# EasyEDA Pro project ProPrj_Embedded Tools_2024-11-13.epro, schematic Communication

## Sheets
1 Misc: Board Name: Communication; Create Date: 2024-09-08; Page Name: Misc; Project Name: Embedded Tools; Schematic Name: Communication; Update Date: 2024-11-03; Company: 嘉立创EDA; Page Size: A4; Version: V1.0
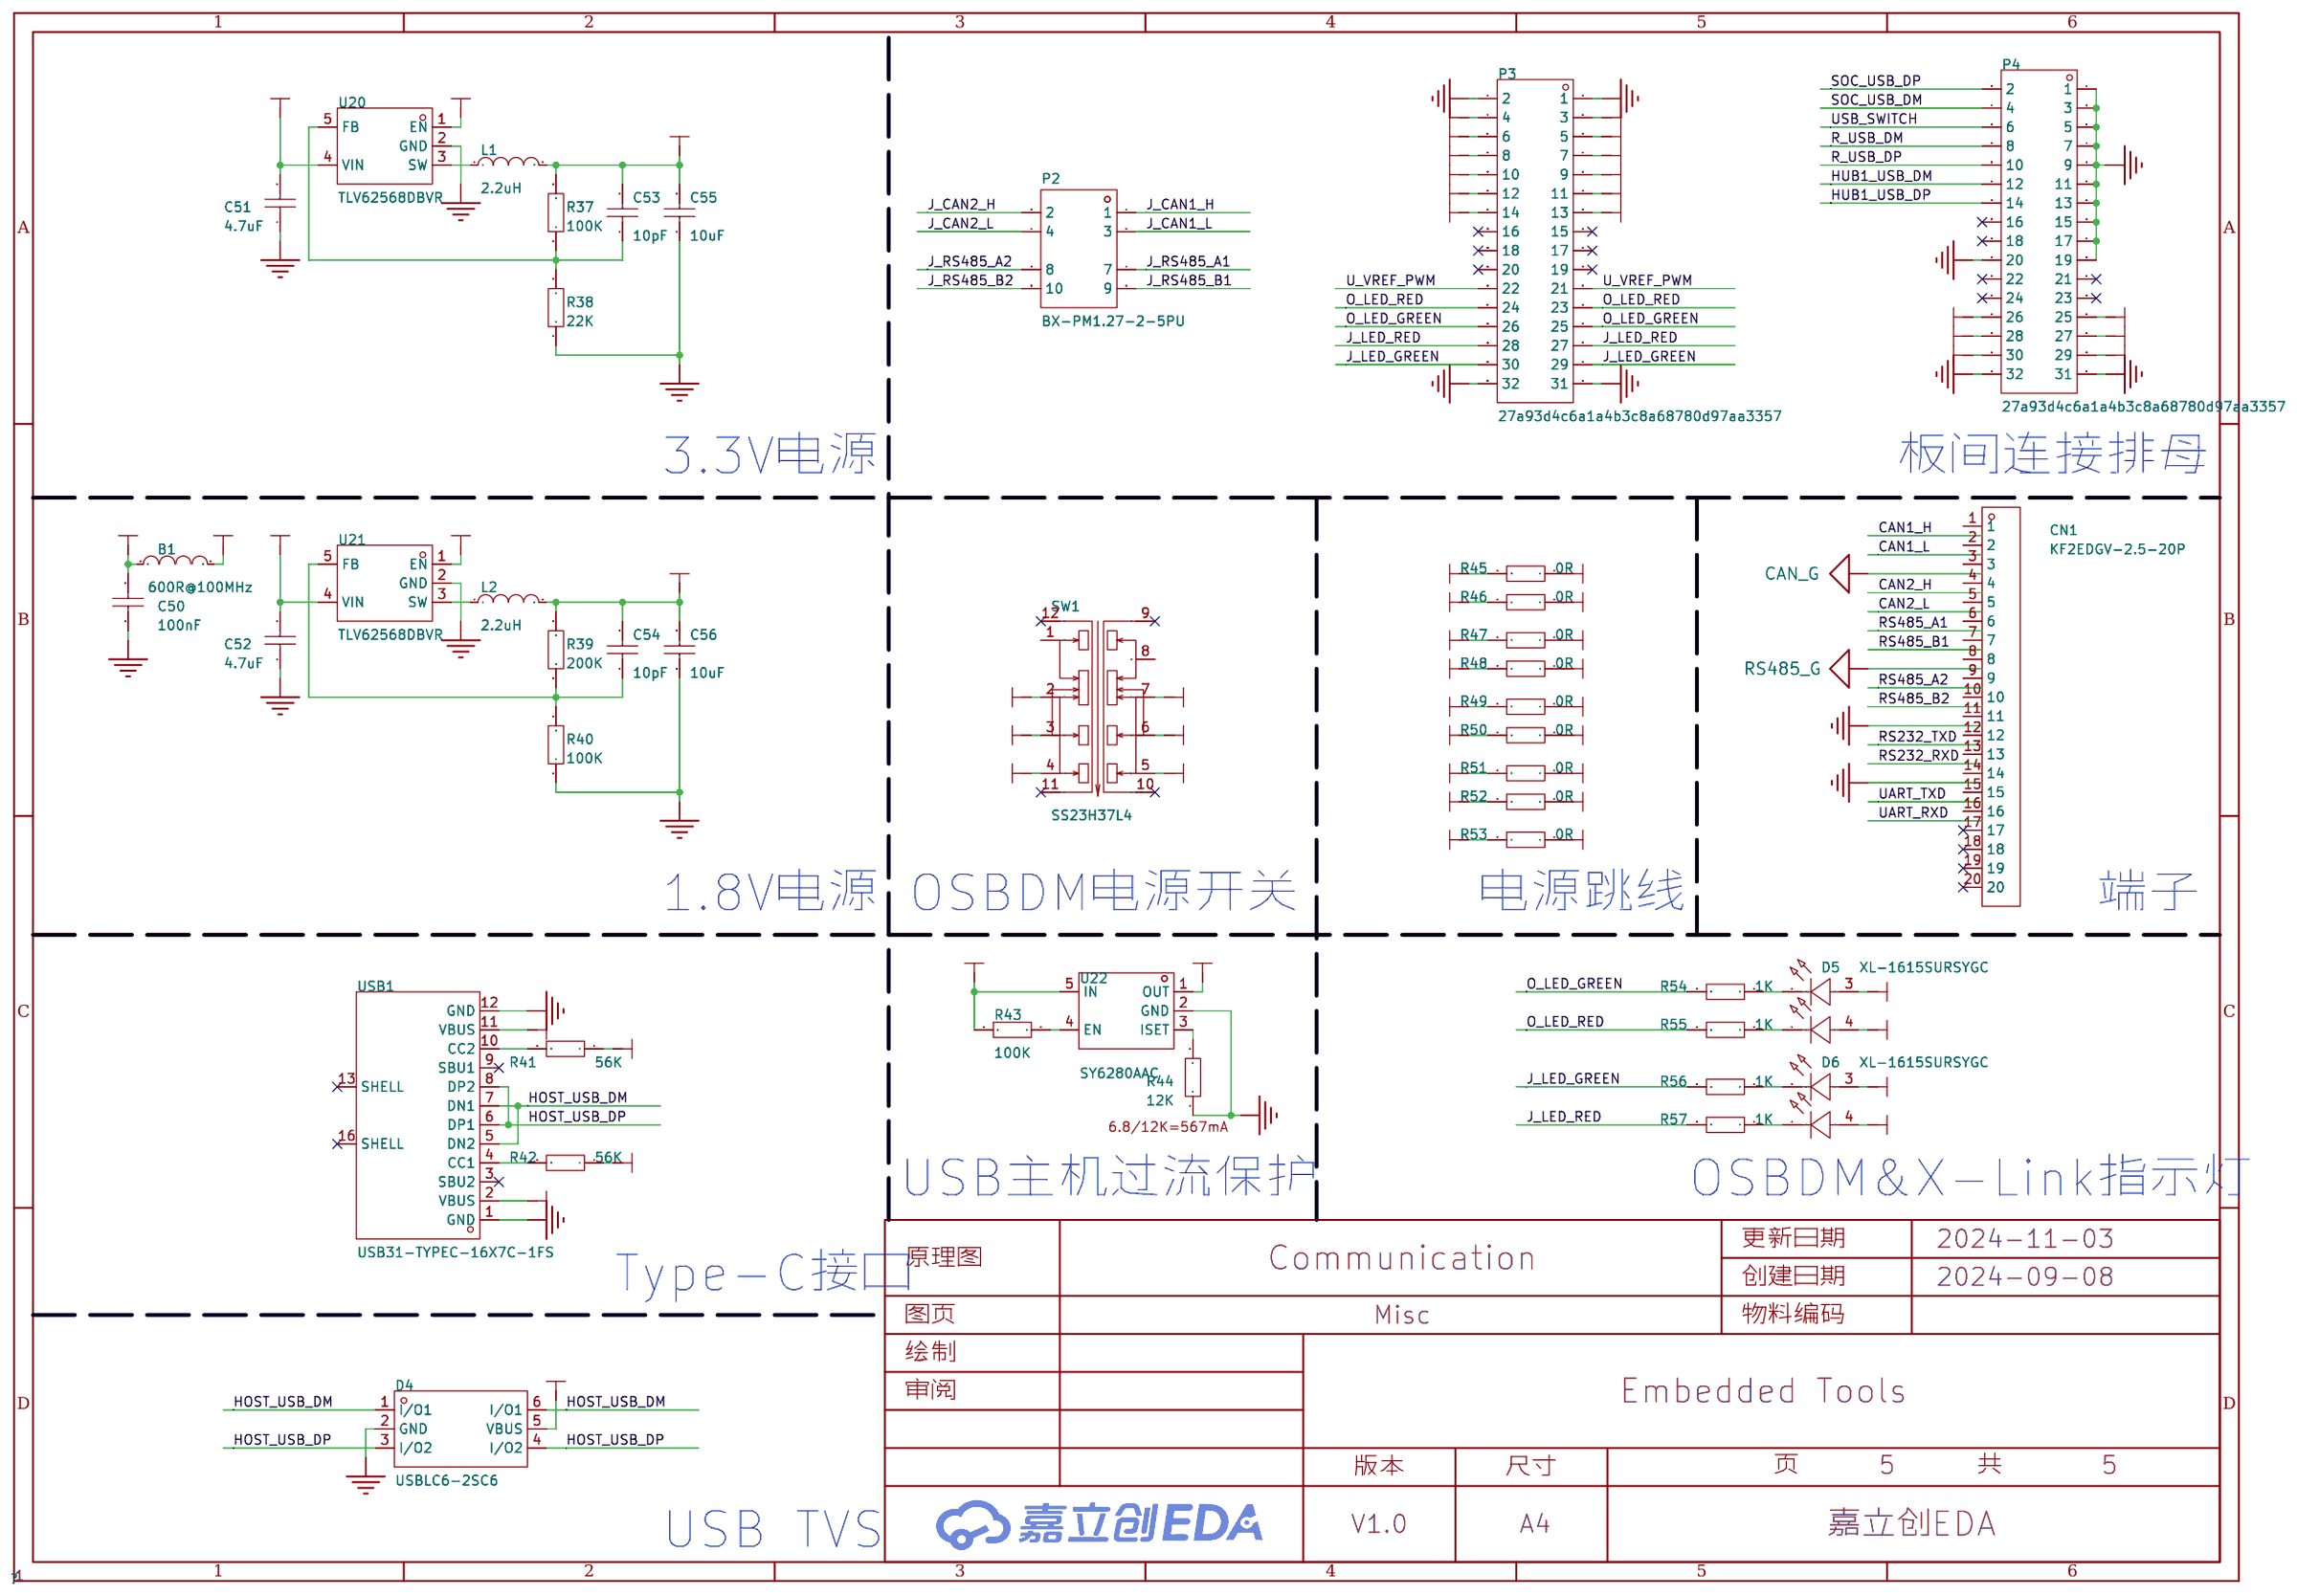
[diagram p0: Misc]
2 UART: Create Date: 2024-09-13; Page Name: UART
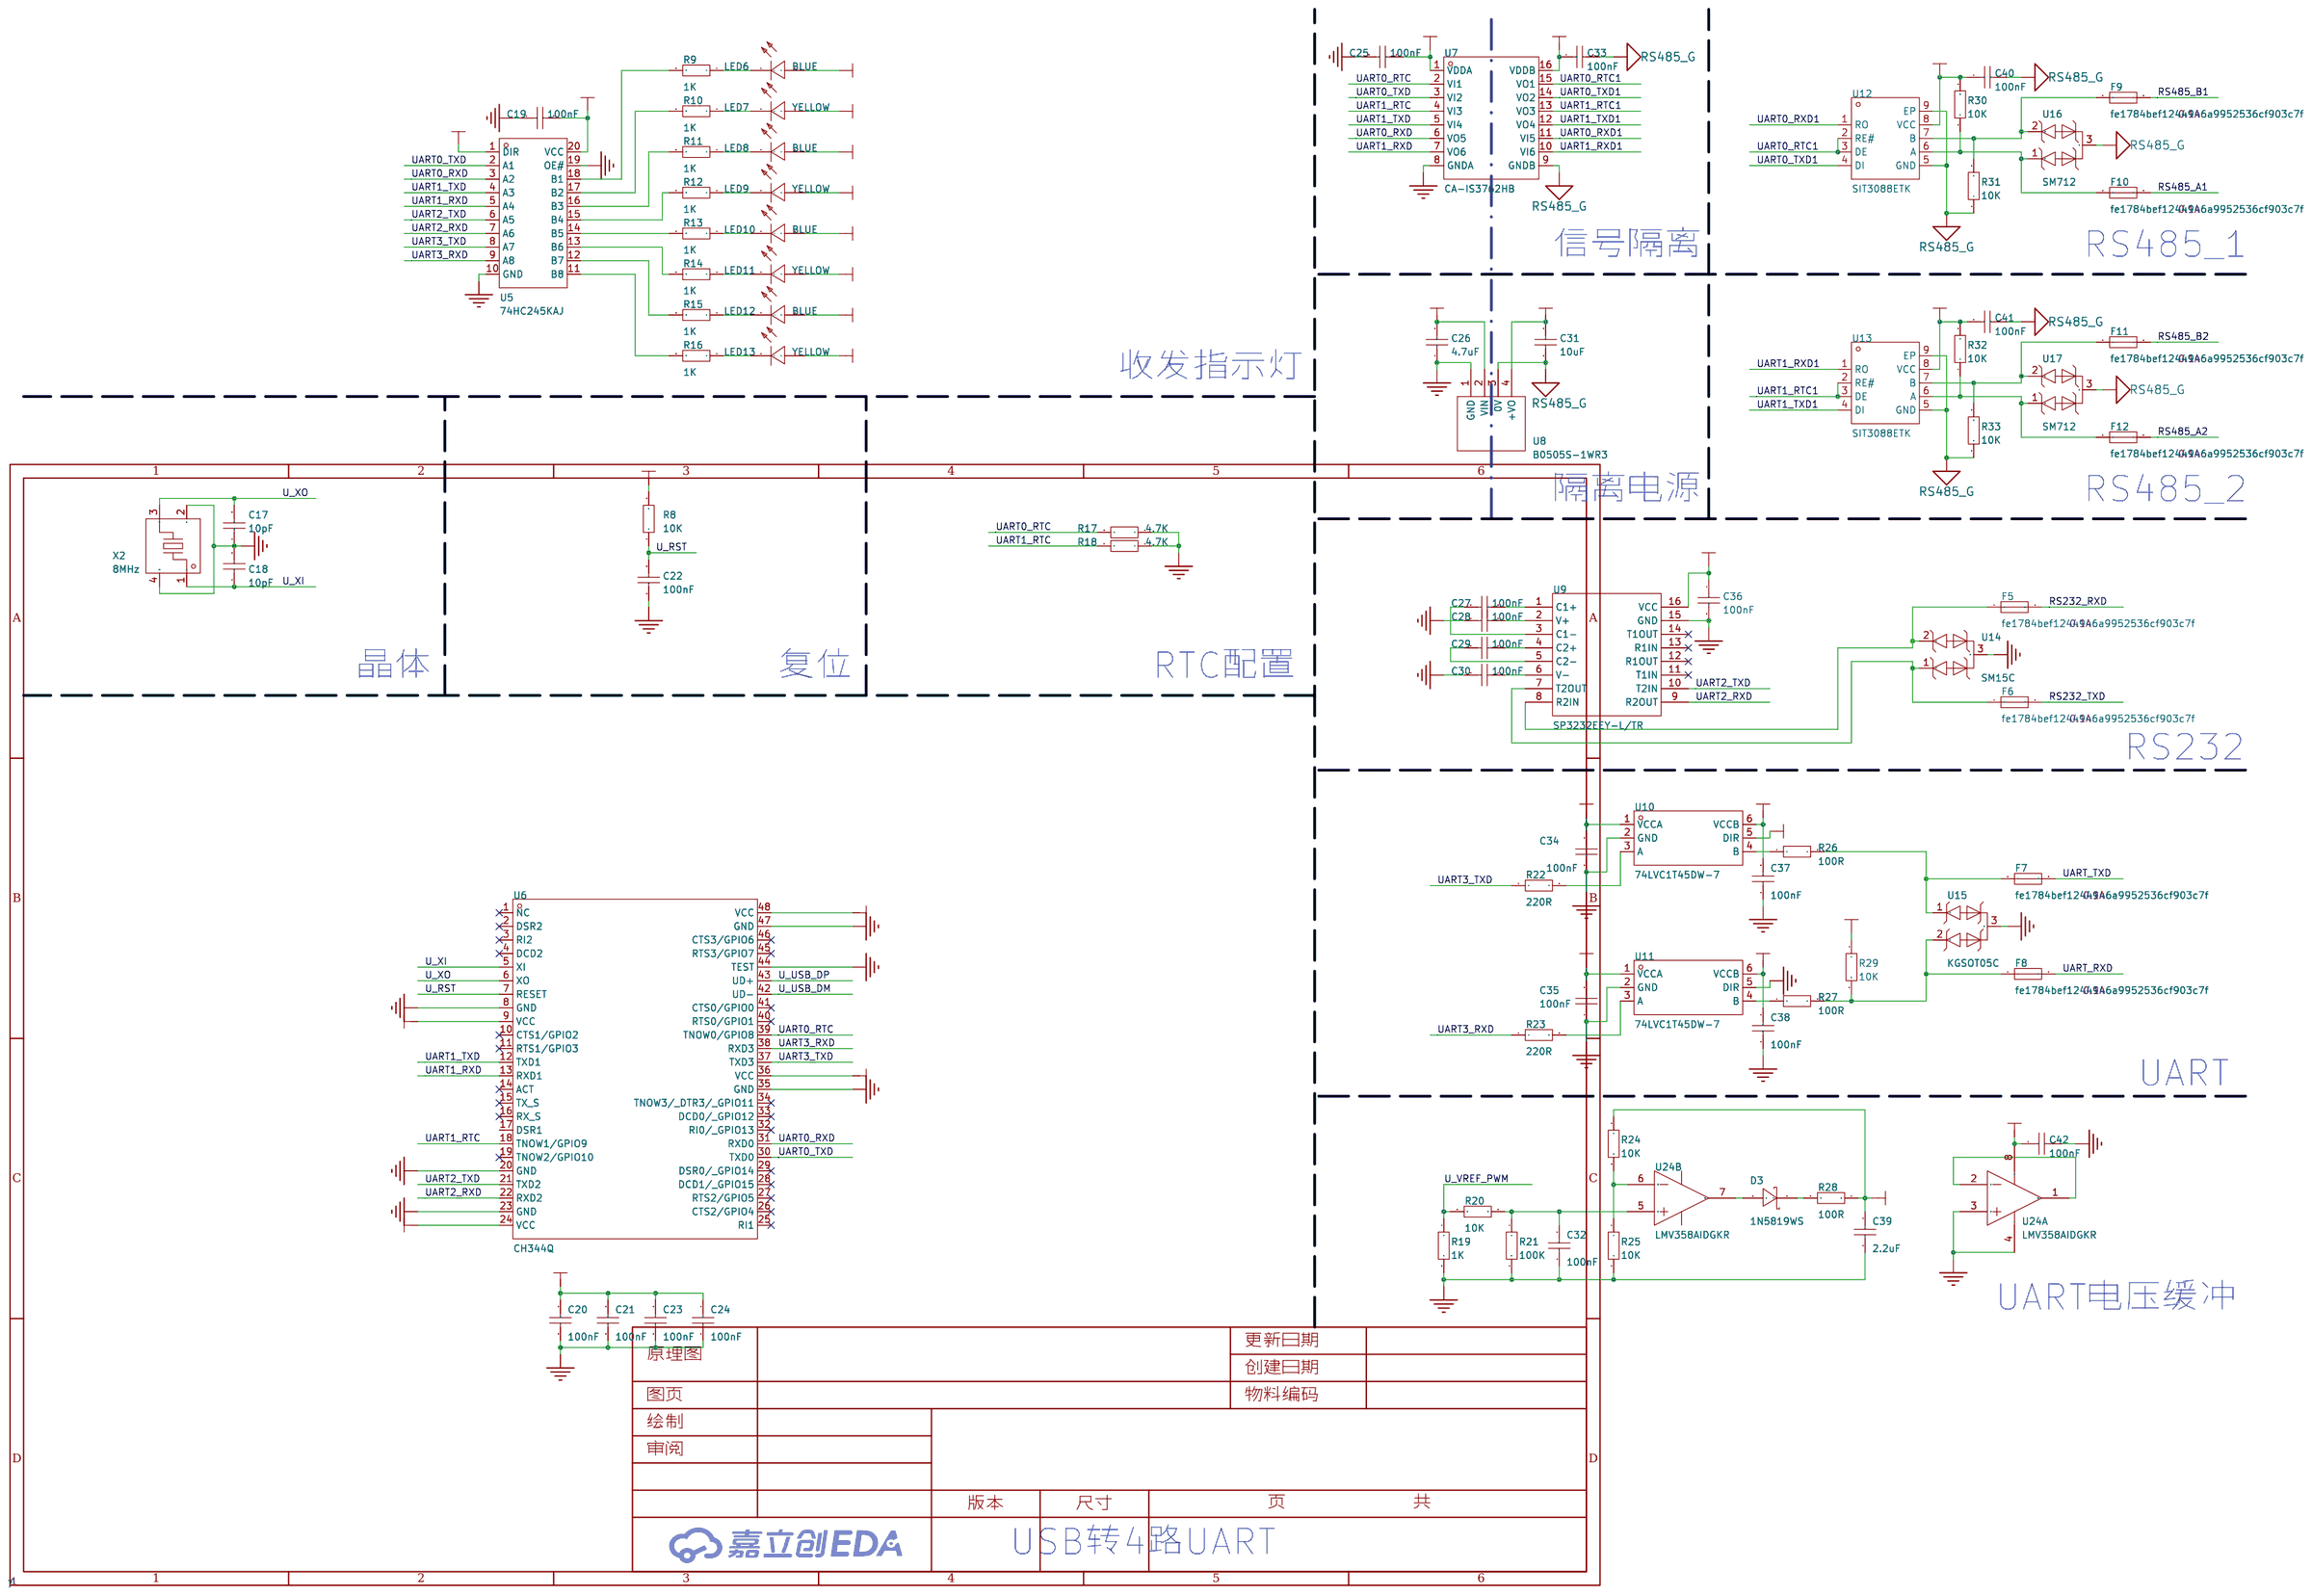
[diagram p1: UART]
3 XN1610: Create Date: 2024-09-19; Page Name: XN1610; Update Date: 2024-10-03
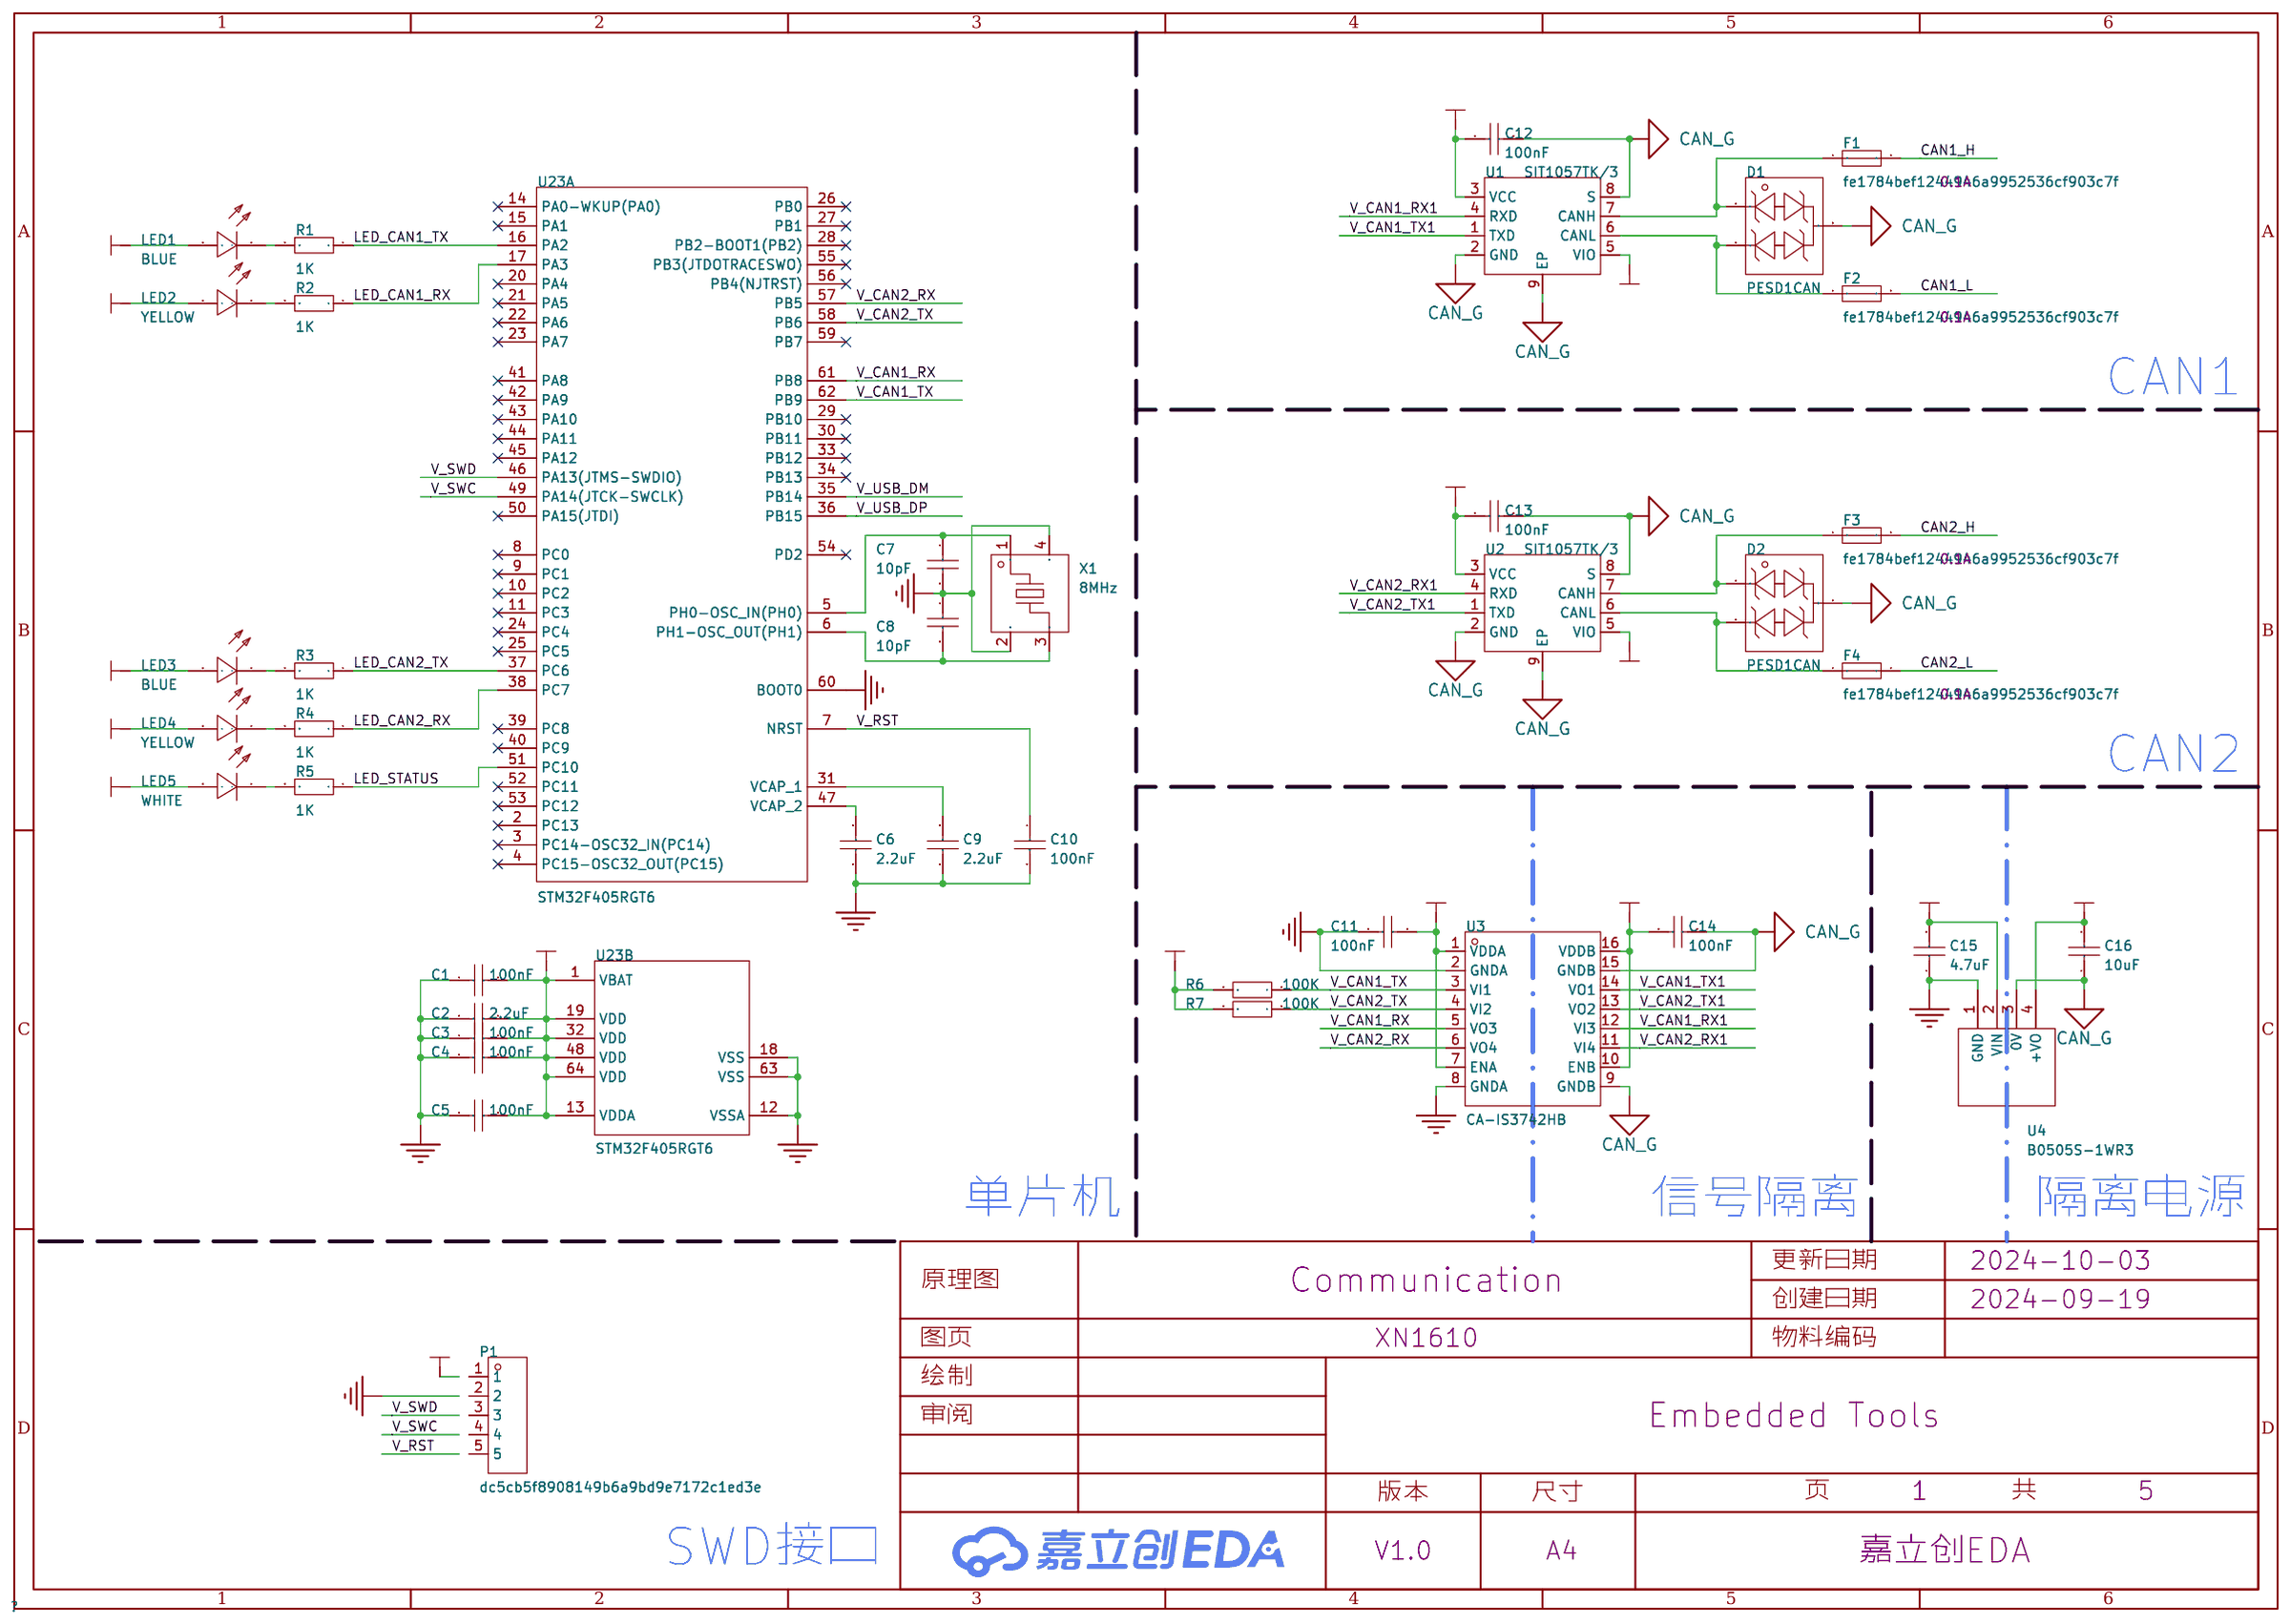
[diagram p2: XN1610]
4 TF Reader: Create Date: 2024-09-25; Page Name: TF Reader; Update Date: 2024-10-02
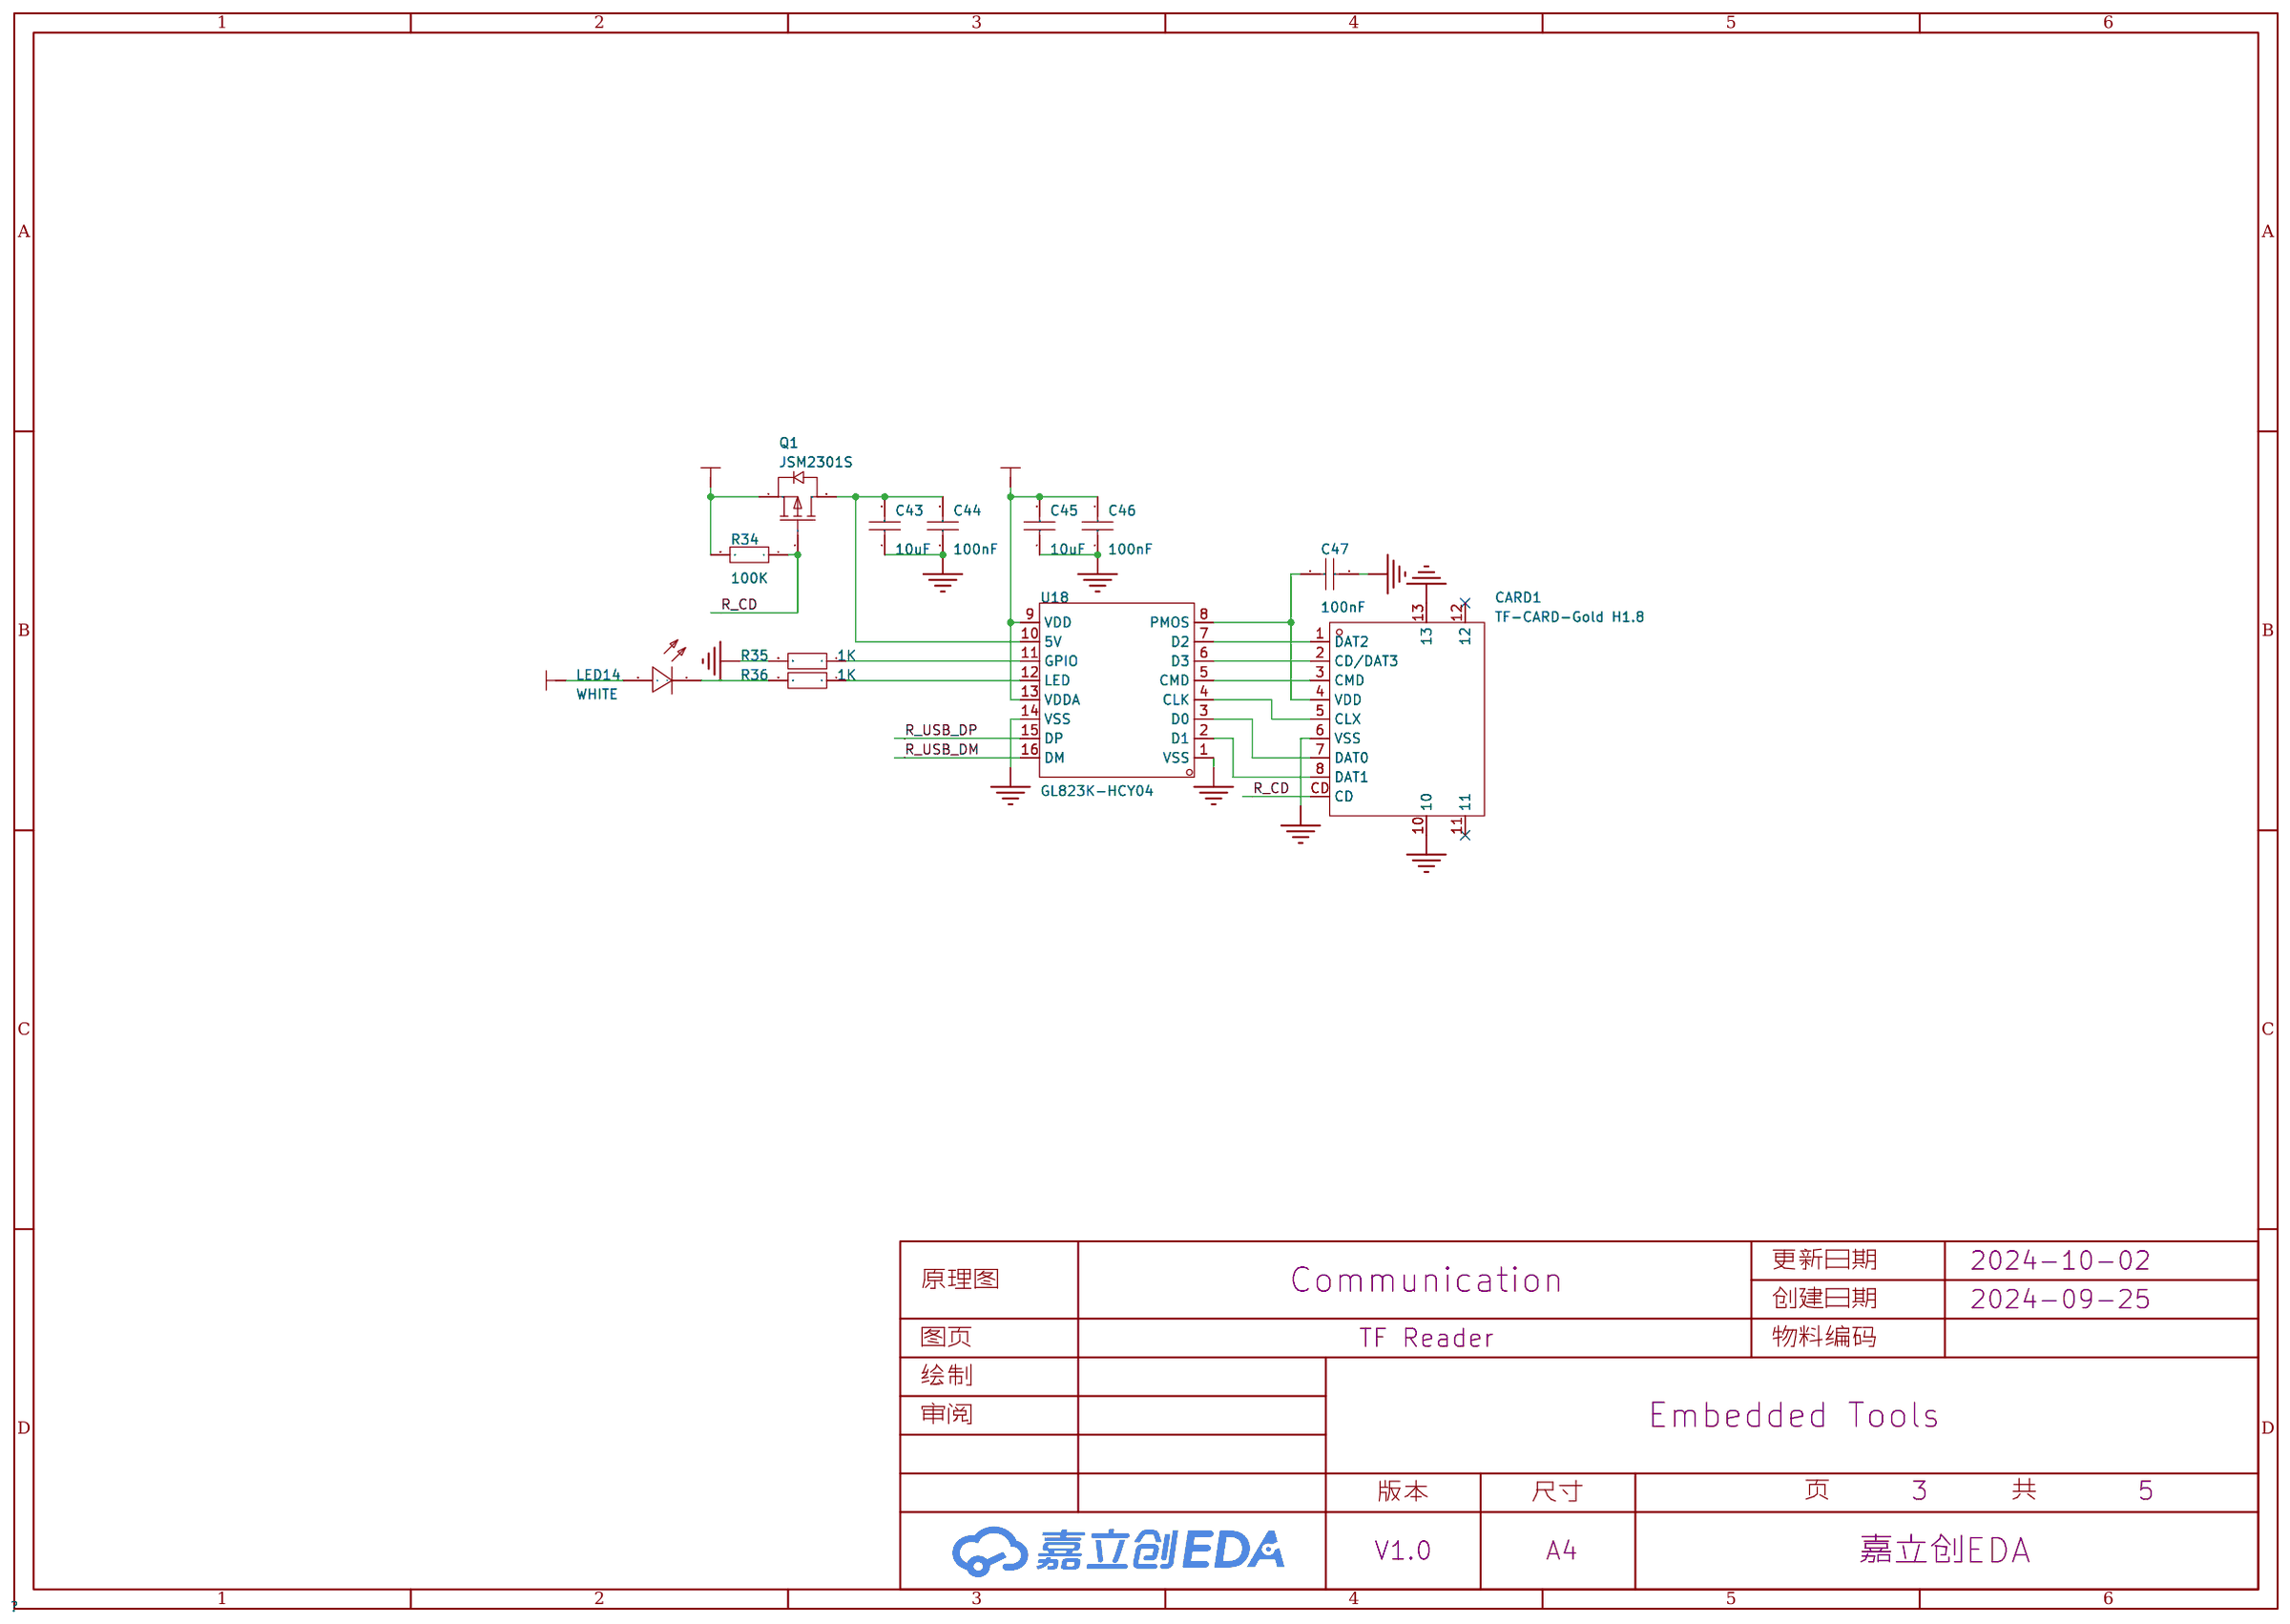
[diagram p3: TF Reader]
5 USB_HUB: Create Date: 2024-09-27; Page Name: USB_HUB; Update Date: 2024-10-01
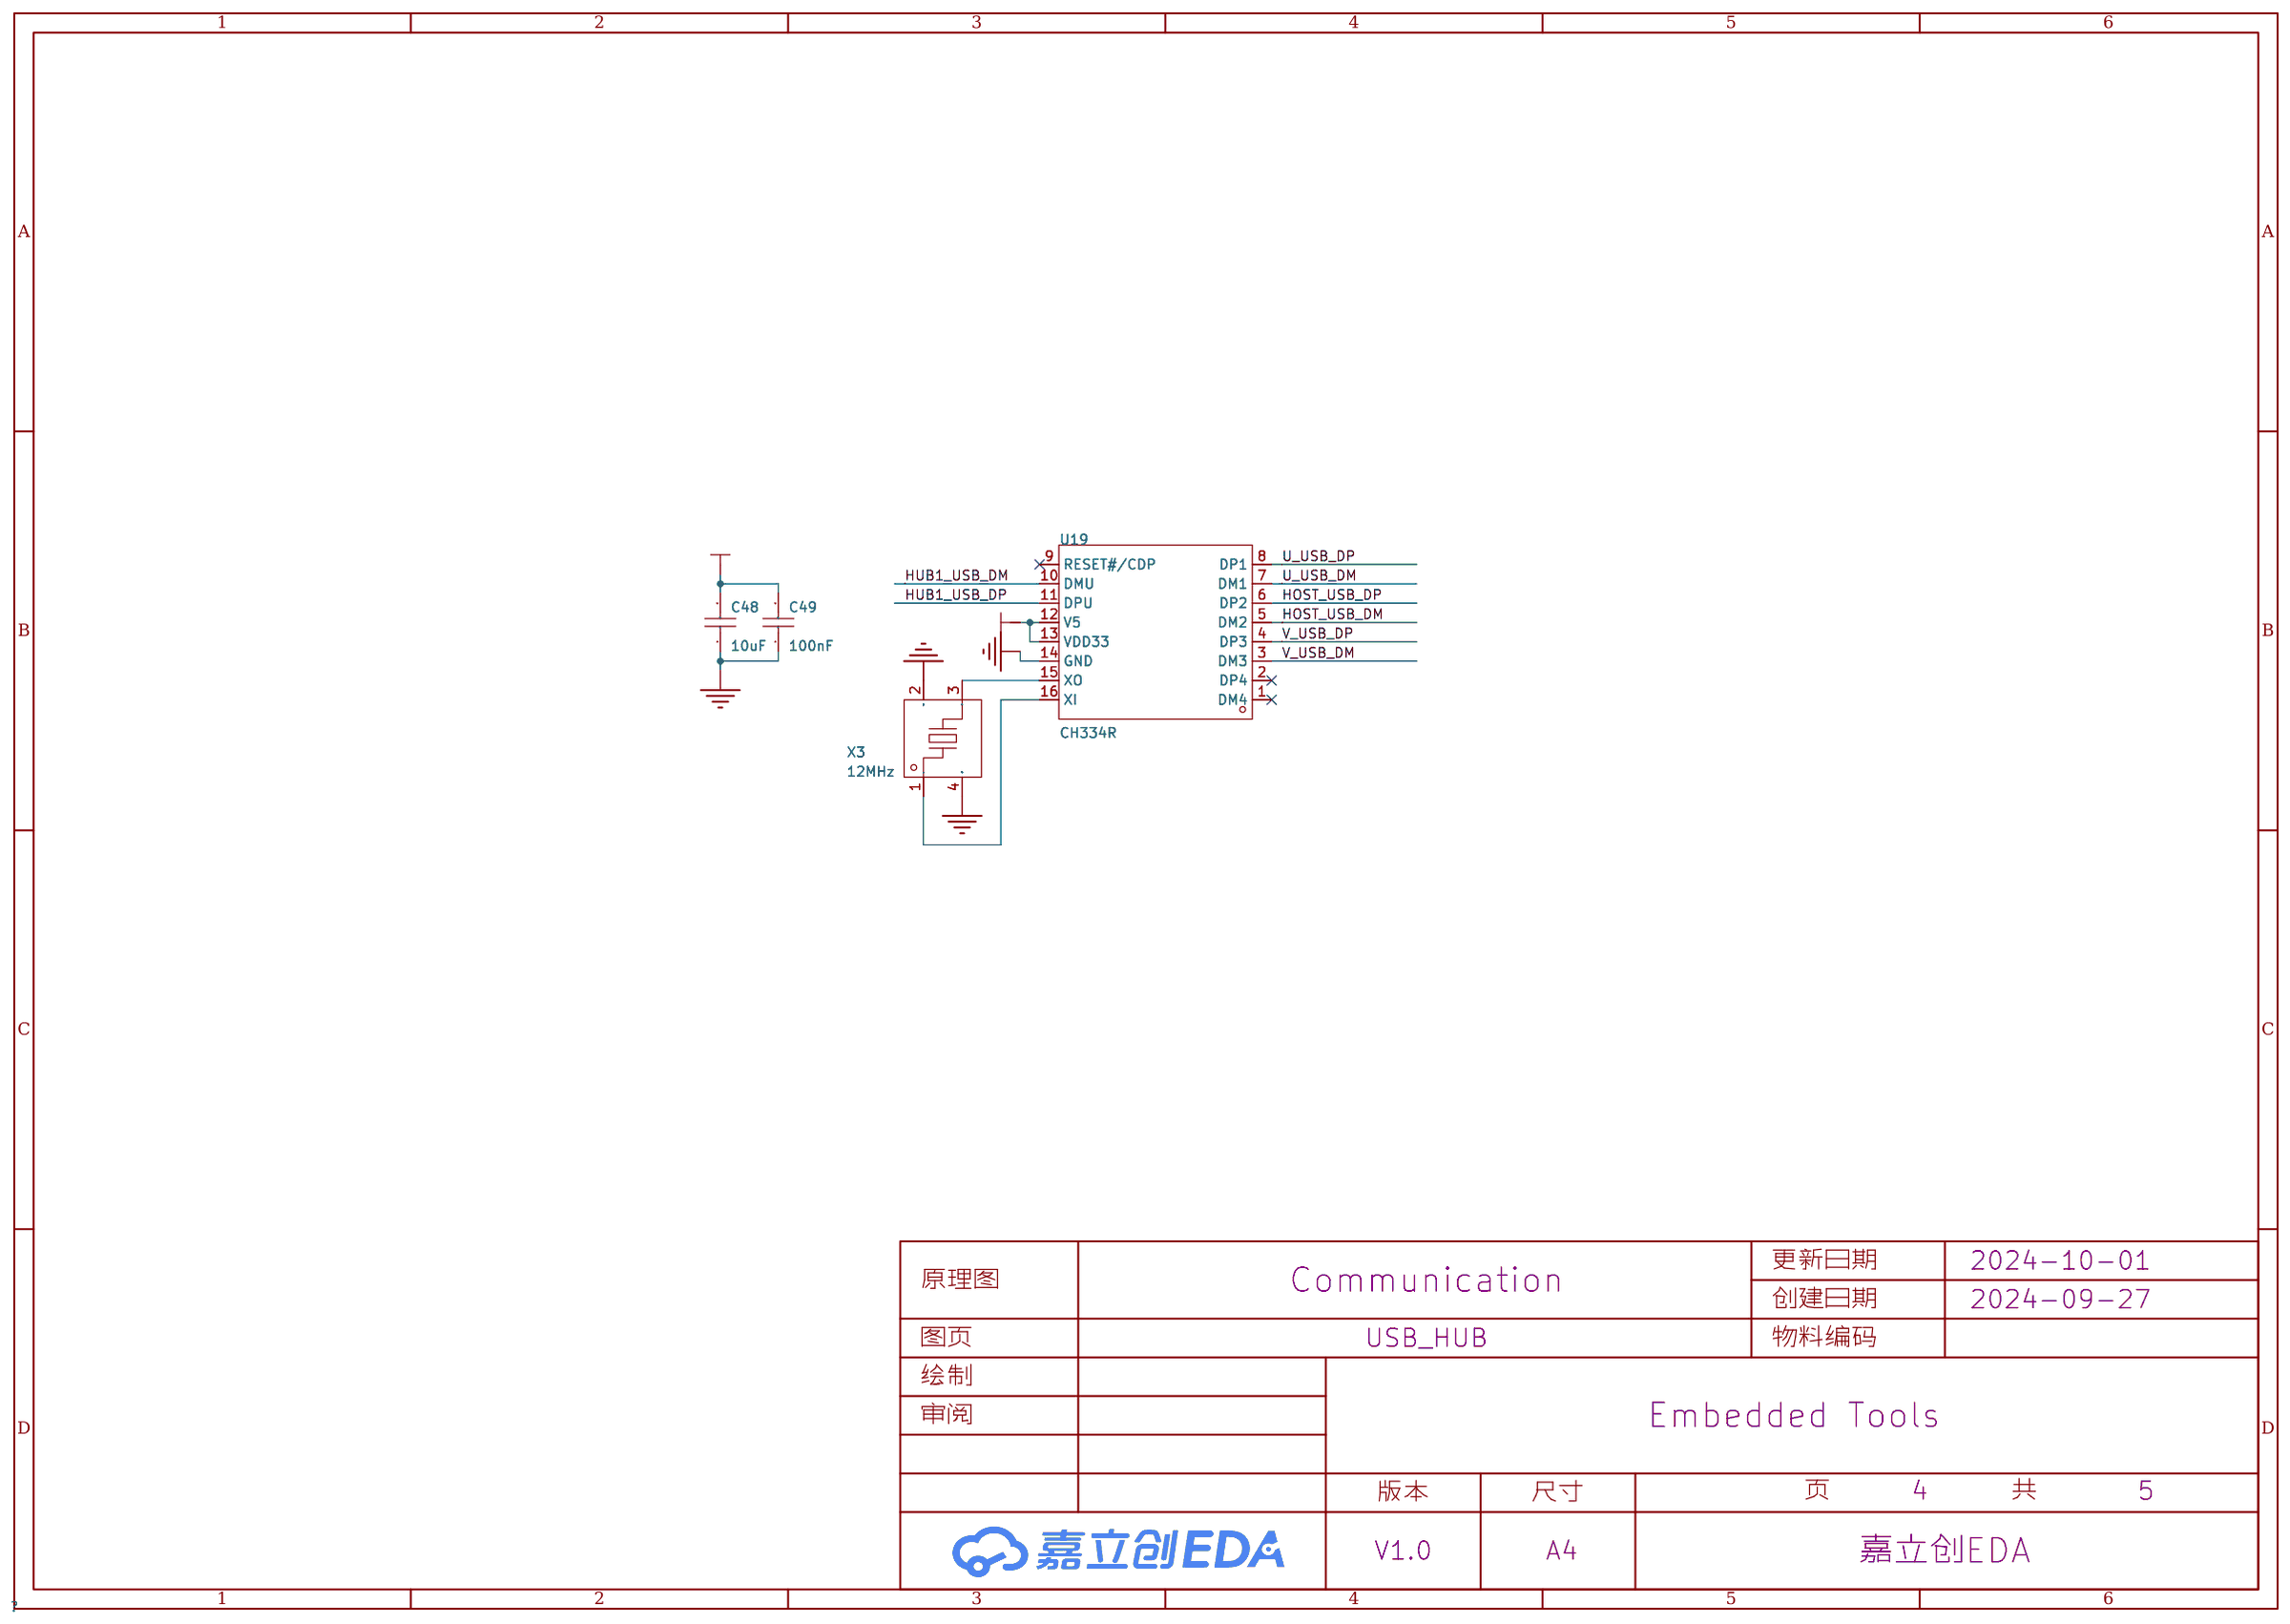
[diagram p4: USB_HUB]

## Parts
sheet Misc
B1  600R@100MHz  [L0603]
C50  100nF  [C0402]
C51  4.7uF  [C0402]
C52  4.7uF  [C0402]
C53  10pF  [C0402]
C54  10pF  [C0402]
C55  10uF  [C0402]
C56  10uF  [C0402]
CN1  KF2EDGV-2.5-20P  [CONN-TH_20P-P2.50_KF2EDGV-2.5-20P_SMD]
D4  USBLC6-2SC6  [SOT-23-6_L2.9-W1.6-P0.95-LS2.8-BL]
D5  XL-1615SURSYGC  [LED1615]
D6  XL-1615SURSYGC  [LED1615]
L1  2.2uH  [IND-SMD_L2.5-W2.0_MHCHL2520]
L2  2.2uH  [IND-SMD_L2.5-W2.0_MHCHL2520]
P2  BX-PM1.27-2-5PU  [HDR-TH_10P-P1.27-V-F-R2-C5-S1.27_1]
P3  27a93d4c6a1a4b3c8a68780d97aa3357  [HDR-TH_32P-P1.27-V-F-R2-C16-S1.27]
P4  27a93d4c6a1a4b3c8a68780d97aa3357  [HDR-TH_32P-P1.27-V-F-R2-C16-S1.27]
R37  100K  [R0402]
R38  22K  [R0402]
R39  200K  [R0402]
R40  100K  [R0402]
R41  56K  [R0402]
R42  56K  [R0402]
R43  100K  [R0402]
R44  12K  [R0402]
R45  0R  [R0603]
R46  0R  [R0603]
R47  0R  [R0603]
R48  0R  [R0603]
R49  0R  [R0603]
R50  0R  [R0603]
R51  0R  [R0603]
R52  0R  [R0603]
R53  0R  [R0603]
R54  1K  [R0402]
R55  1K  [R0402]
R56  1K  [R0402]
R57  1K  [R0402]
SW1  SS23H37L4  [SW-TH_SS23H37LX_SMD]
U20  TLV62568DBVR  [SOT-23-5_L3.0-W1.7-P0.95-LS2.8-BR]
U21  TLV62568DBVR  [SOT-23-5_L3.0-W1.7-P0.95-LS2.8-BR]
U22  SY6280AAC  [SOT-23-5_L3.0-W1.7-P0.95-LS2.8-BL]
USB1  USB31-TYPEC-16X7C-1FS  [USB-SMD_USB31-TYPEC-16X7C-1FS]
sheet TF Reader
C43  10uF  [C0402]
C44  100nF  [C0402]
C45  10uF  [C0402]
C46  100nF  [C0402]
C47  100nF  [C0402]
CARD1  TF-CARD-Gold H1.8  [TF-SMD_TF-PUSH]
LED14  WHITE  [LED0603]
Q1  JSM2301S  [SOT-23_L2.9-W1.3-P1.90-LS2.4-BR]
R34  100K  [R0402]
R35  1K  [R0402]
R36  1K  [R0402]
U18  GL823K-HCY04  [SSOP-16_L4.9-W3.9-P0.64-LS6.0-BL]
sheet UART
C17  10pF  [C0402]
C18  10pF  [C0402]
C19  100nF  [C0402]
C20  100nF  [C0402]
C21  100nF  [C0402]
C22  100nF  [C0402]
C23  100nF  [C0402]
C24  100nF  [C0402]
C25  100nF  [C0402]
C26  4.7uF  [C0402]
C27  100nF  [C0402]
C28  100nF  [C0402]
C29  100nF  [C0402]
C30  100nF  [C0402]
C31  10uF  [C0402]
C32  100nF  [C0402]
C33  100nF  [C0402]
C34  100nF  [C0402]
C35  100nF  [C0402]
C36  100nF  [C0402]
C37  100nF  [C0402]
C38  100nF  [C0402]
C39  2.2uF  [C0402]
C40  100nF  [C0402]
C41  100nF  [C0402]
C42  100nF  [C0402]
D3  1N5819WS  [SOD-323_L1.8-W1.3-LS2.5-RD]
F5  fe1784bef1244946a9952536cf903c7f  [F0805]
F6  fe1784bef1244946a9952536cf903c7f  [F0805]
F7  fe1784bef1244946a9952536cf903c7f  [F0805]
F8  fe1784bef1244946a9952536cf903c7f  [F0805]
F9  fe1784bef1244946a9952536cf903c7f  [F0805]
F10  fe1784bef1244946a9952536cf903c7f  [F0805]
F11  fe1784bef1244946a9952536cf903c7f  [F0805]
F12  fe1784bef1244946a9952536cf903c7f  [F0805]
LED6  BLUE  [LED0603]
LED7  YELLOW  [LED0603]
LED8  BLUE  [LED0603]
LED9  YELLOW  [LED0603]
LED10  BLUE  [LED0603]
LED11  YELLOW  [LED0603]
LED12  BLUE  [LED0603]
LED13  YELLOW  [LED0603]
R8  10K  [R0402]
R9  1K  [R0402]
R10  1K  [R0402]
R11  1K  [R0402]
R12  1K  [R0402]
R13  1K  [R0402]
R14  1K  [R0402]
R15  1K  [R0402]
R16  1K  [R0402]
R17  4.7K  [R0402]
R18  4.7K  [R0402]
R19  1K  [R0402]
R20  10K  [R0402]
R21  100K  [R0402]
R22  220R  [R0402]
R23  220R  [R0402]
R24  10K  [R0402]
R25  10K  [R0402]
R26  100R  [R0402]
R27  100R  [R0402]
R28  100R  [R0402]
R29  10K  [R0402]
R30  10K  [R0402]
R31  10K  [R0402]
R32  10K  [R0402]
R33  10K  [R0402]
U5  74HC245KAJ  [TSSOP-20_L6.5-W4.4-P0.65-LS6.4-BL]
U6  CH344Q  [LQFP-48_L7.0-W7.0-P0.50-LS9.0-BL]
U7  CA-IS3762HB  [SSOP-16_L4.9-W3.9-P0.64-LS6.0-BL-1]
U8  B0505S-1WR3  [PWRM-TH_B0503S-1WR2_S_1]
U9  SP3232EEY-L/TR  [TSSOP-16_L5.0-W4.4-P0.65-LS6.4-BL]
U10  74LVC1T45DW-7  [SC-70-6_L2.2-W1.3-P0.65-LS2.1-BR]
U11  74LVC1T45DW-7  [SC-70-6_L2.2-W1.3-P0.65-LS2.1-BR]
U12  SIT3088ETK  [DFN-8_L3.0-W3.0-P0.65-BL-EP]
U13  SIT3088ETK  [DFN-8_L3.0-W3.0-P0.65-BL-EP]
U14  SM15C  [SOT-23-3_L2.9-W1.6-P1.90-LS2.8-BR]
U15  KGSOT05C  [SOT-23-3_L2.9-W1.6-P1.90-LS2.8-BR]
U16  SM712  [SOT-23-3_L2.9-W1.6-P1.90-LS2.8-BR]
U17  SM712  [SOT-23-3_L2.9-W1.6-P1.90-LS2.8-BR]
U24  LMV358AIDGKR  [VSSOP-8_L3.0-W3.0-P0.65-LS5.0-BL]  (sections 1,2)
X2  8MHz  [CRYSTAL-SMD_4P-L3.2-W2.5-BL-A]
sheet USB_HUB
C48  10uF  [C0402]
C49  100nF  [C0402]
U19  CH334R  [QSOP-16_L4.9-W3.9-P0.64-LS6.0-BL]
X3  12MHz  [CRYSTAL-SMD_4P-L2.5-W2.0-BL-A]
sheet XN1610
C1  100nF  [C0402]
C2  2.2uF  [C0402]
C3  100nF  [C0402]
C4  100nF  [C0402]
C5  100nF  [C0402]
C6  2.2uF  [C0402]
C7  10pF  [C0402]
C8  10pF  [C0402]
C9  2.2uF  [C0402]
C10  100nF  [C0402]
C11  100nF  [C0402]
C12  100nF  [C0402]
C13  100nF  [C0402]
C14  100nF  [C0402]
C15  4.7uF  [C0402]
C16  10uF  [C0402]
D1  PESD1CAN  [SOT-23-3_L2.9-W1.6-P1.90-LS2.8-BR]
D2  PESD1CAN  [SOT-23-3_L2.9-W1.6-P1.90-LS2.8-BR]
F1  fe1784bef1244946a9952536cf903c7f  [F0805]
F2  fe1784bef1244946a9952536cf903c7f  [F0805]
F3  fe1784bef1244946a9952536cf903c7f  [F0805]
F4  fe1784bef1244946a9952536cf903c7f  [F0805]
LED1  BLUE  [LED0603]
LED2  YELLOW  [LED0603]
LED3  BLUE  [LED0603]
LED4  YELLOW  [LED0603]
LED5  WHITE  [LED0603]
P1  dc5cb5f8908149b6a9bd9e7172c1ed3e  [HDR-TH_5P-P1.27-V-M]
R1  1K  [R0402]
R2  1K  [R0402]
R3  1K  [R0402]
R4  1K  [R0402]
R5  1K  [R0402]
R6  100K  [R0402]
R7  100K  [R0402]
U1  SIT1057TK/3  [DFN-8_L3.0-W3.0-P0.65-BL-EP-1]
U2  SIT1057TK/3  [DFN-8_L3.0-W3.0-P0.65-BL-EP-1]
U3  CA-IS3742HB  [SSOP-16_L4.9-W3.9-P0.64-LS6.0-BL]
U4  B0505S-1WR3  [PWRM-TH_B0503S-1WR2_S_1]
U23  STM32F405RGT6  [LQFP-64_L10.0-W10.0-P0.50-LS12.0-BL]  (sections 1,2)
X1  8MHz  [CRYSTAL-SMD_4P-L3.2-W2.5-BL-A]

## Library data of the parts
B1 = B0603
C1-C56 = C0402
CN1 = KF2EDGV-2.5-20P_SMD: 连接器类型:板端/插座-闭口;结构:1x20P;间距:2.5mm;颜色:绿色;安装方式:直针;排数:1;每排PIN数:20;额定电流:5A;额定电压:130V;工作温度范围:-40℃~+105℃;; Manufacturer: KEFA(科发); LCSC Part Name: 2.5mm 1x20P 排数:1 每排P数:12; Supplier Footprint: 插件,P=2.5mm; Datasheet: https://atta.szlcsc.com/upload/public/pdf/source/20230331/42B19528A5E5EB4961D58C25F51AA2DA.pdf; Connector Type: 板端/插座-闭口; Structure: 1x20P; Pitch: 2.5mm; Color: 绿色; Mounting Style: 直针; Number of Pins: 20P; Number of Rows: 1; Number of PINs Per Row: 20; Current Rating (Max): 5A; Voltage Rating (Max): 130V; Operating Temperature Range: -40℃~+105℃
D4 = USBLC6-2SC6: 最大钳位电压:15V;击穿电压:6V;; Supplier Part: C2687116; Manufacturer: UMW(友台半导体); Supplier Footprint: SOT-23-6; JLCPCB Part Class: 扩展库; Datasheet: https://atta.szlcsc.com/upload/public/pdf/source/20231109/512642D850D9873E7C519F71E85B9A10.pdf; Supplier: LCSC; Maximum Clamping Voltage: 15V; Breakdown Voltage: 6V; Number of Lines: 双路; Type: ESD
D5 D6 = LED1615: Manufacturer: XINGLIGHT(成兴光); Supplier: LCSC; Supplier Part: C965838
L1 L2 = APH252010T2R2M: 电感值:2.2uH;精度:±20%;额定电流:2.1A;饱和电流(Isat):3A;类型:一体成型电感;; LCSC Part Name: 2.2uH ±20% 3A; Supplier Part: C5349606; Manufacturer: APV(爱普微); Supplier Footprint: 1008; JLCPCB Part Class: Extended Part; Datasheet: https://atta.szlcsc.com/upload/public/pdf/source/20240422/625E1A31A240F2D65C1915745A2472C0.pdf; Supplier: LCSC; Tolerance: ±20%; Rated Current: 2.1A; Saturation Current (Isat): 3A; DC Resistance (DCR): 70mΩ; Type: 一体成型电感
P2 = PM1.27-2x5_1: LCSC Part Name: 2x5P 间距:1.27mm 直插; Supplier Part: C18078163; Manufacturer: Bossie(博锡); Supplier Footprint: 插件,P=1.27mm; JLCPCB Part Class: 扩展库; Datasheet: https://atta.szlcsc.com/upload/public/pdf/source/20231017/4E597B7B87E6CE3BA1753684924A3004.pdf; Supplier: LCSC; Holes Structure: 2x5P; Pitch: 1.27mm; Row Spacing: 1.27mm; Circular Hole / Square Hole: 方孔; Mounting Type: 直插; Number of Rows: 双排; Voltage Rating (Max): 1kV; Holes Direction: 顶部; Insulation Height: 4.3mm; Contact Plating: 金; Operating Temperature Range: -40℃~+105℃; Soldering Temperature(Max): 260℃@5S
P3 P4 = PM1.27-2x16: 插孔结构:2x16P;间距:1.27mm;行距:1.27mm;圆孔/方孔:方孔;安装类型:直插;排数:双排;总孔位数:32P;额定电流:1A;额定电压:250V;插孔方向:顶部;塑高:4.3mm;触头材质:黄铜;触头镀层:金;工作温度范围:-40℃~+105℃;焊接温度(最大值):260℃;; LCSC Part Name: 间距:1.27mm 2x16P 直插; Supplier Footprint: 插件,P=1.27mm; Datasheet: https://atta.szlcsc.com/upload/public/pdf/source/20211011/FBC347F111AD352C74B01A11A3D7EF4F.pdf; Holes Structure: 2x16P; Pitch: 1.27mm; Row Spacing: 1.27mm; Circular Hole / Square Hole: 方孔; Mounting Type: 直插; Number of Rows: 双排; Number of Holes: 32P; Current Rating (Max): 1A; Voltage Rating (Max): 250V; Holes Direction: 顶部; Insulation Height: 4.3mm; Contact Material: 黄铜; Contact Plating: 金; Operating Temperature Range: -40℃~+105℃; Soldering Temperature(Max): 260℃
R1-R5 R9-R29 R34-R44 R54-R57 = R0402
R45-R53 = R0603
SW1 = SS23H37L4_SMD: 电路结构:双刀三掷;安装方式:直插;开关颜色:黑色;额定电流(DC):300mA;额定电压(DC):50V;额定电流(AC):300mA;额定电压(AC):50V;机械寿命:1万次;; Supplier: LCSC; Supplier Part: C883268; Manufacturer: XKB Connectivity(中国星坤); LCSC Part Name: 柄长4mm 直插三档 滑动开关; Supplier Footprint: 插件; Datasheet: https://atta.szlcsc.com/upload/public/pdf/source/20211011/B42684107FED9ECA6747C430E689FA80.pdf; Circuit: 双刀三掷; Actuator Style: 矩形柱状; Pin Style: PC引脚; Switch Length: 19.5mm; Switch Width: 6.6mm; Switch Height: 8mm; Mounting Style: 直插; Actuator Color: 黑色; Current Rating (DC): 300mA; Voltage Rating (DC): 50V; Current Rating (AC): 300mA; Voltage Rating (AC): 50V; Mechanical Life: 1万次; Operating Temperature: -40℃~+85℃
U20 U21 = TLV62568DBVR: 功能类型:降压型;输出类型:可调;输入电压:2.5V~5.5V;输出电压:600mV~5.5V;输出电流(最大值):1A;; Supplier Part: C163219; Manufacturer: TI(德州仪器); Supplier Footprint: SOT-23-5; JLCPCB Part Class: 扩展库; Datasheet: https://www.ti.com/cn/lit/gpn/tlv62568; Supplier: LCSC; Function: 降压型; Output Type: 可调; Input Voltage: 2.5V~5.5V; Output Voltage: 600mV~5.5V; Output Current (Max): 1A; Switching Frequency: 1.5MHz; Operating Temperature: -40℃~+125℃@(TJ); Synchronous Rectification: 是; Number of Outputs: 1; Topology: 降压式; Switch tube (built-in/external): 内置
U22 = SY6280AAC_C55136: 低能耗配电开关; Supplier Part: C55136; Manufacturer: silergy(矽力杰); Supplier Footprint: SOT-23-5; JLCPCB Part Class: 扩展库; Datasheet: https://atta.szlcsc.com/upload/public/pdf/source/20161108/1478586372822.pdf; Supplier: LCSC
USB1 = USB31-TYPEC-16X7C-1FS: 连接器类型:Type-C;标准:USB 3.1;公母:母;安装方式:沉板;触点数量:24P;端口数量:1;额定电流 - 电源:3A;触头材质:磷青铜;触头镀层:金;工作温度范围:-25℃~+80℃;焊接温度(最大值):260℃;; LCSC Part Name: Type-C 母 沉板 两件套; Supplier Part: C2880667; Manufacturer: XKB Connection(中国星坤); Supplier Footprint: SMD; JLCPCB Part Class: 扩展库; Datasheet: https://atta.szlcsc.com/upload/public/pdf/source/20211011/8558E12E1491007827A313C13D78E73E.pdf; Supplier: LCSC; Connector Type: Type-C; Standard: USB 3.1; Gender: 母; Mounting Style: 沉板; Number of Contacts: 24P; Number of Ports: 1; Current Rating - Power (Max): 3A; Contact Material: 磷青铜; Contact Plating: 金; Operating Temperature Range: -25℃~+80℃; Soldering Temperature(Max): 260℃
CARD1 = TF-CARD-Gold H1.8: 卡连接方式:自弹式;卡类型:MicroSD卡(TF卡);连接器类型:卡座;本体最大高度:1.8mm;工作温度范围:-40℃~+70℃;; LCSC Part Name: 自弹式 MicroSD卡(TF卡) 卡座; Supplier Part: C7529390; Manufacturer: SHOU HAN(首韩); Supplier Footprint: SMD; JLCPCB Part Class: Extended Part; Datasheet: https://atta.szlcsc.com/upload/public/pdf/source/20230818/FAF566DD66A52515386E50168BE66EDA.pdf; Supplier: LCSC; Card Connection Mode: 自弹式; Card Type: MicroSD卡(TF卡); Connector Type: 卡座; Maximum Body Height: 1.8mm; Operating Temperature Range: -40℃~+70℃
LED1-LED14 = LED0603
Q1 = JSM2301S: 类型:1个P沟道;漏源电压(Vdss):20V;连续漏极电流(Id):2.3A;导通电阻(RDS(on)@Vgs,Id):90mΩ@4.5V,2.8A;功率(Pd):350mW;阈值电压(Vgs(th)@Id):1V@250uA;; LCSC Part Name: 1个P沟道 耐压:20V 电流:2.3A; Supplier Part: C916399; Manufacturer: JSMSEMI(杰盛微); Supplier Footprint: SOT-23; JLCPCB Part Class: Extended Part; Datasheet: https://atta.szlcsc.com/upload/public/pdf/source/20240815/90FEEB8A4CE9D4EC8C7D16A6A62ABEAA.pdf; Supplier: LCSC; Type: 1个P沟道; Drain Source Voltage (Vdss): 20V; Continuous Drain Current (Id): 2.3A; Drain Source On Resistance (RDS(on)@Vgs,Id): 90mΩ@4.5V,2.8A; Power Dissipation (Pd): 350mW; Gate Threshold Voltage (Vgs(th)@Id): 1V@250uA; Total Gate Charge (Qg@Vgs): 5.4nC@4.5V; Input Capacitance (Ciss@Vds): 405pF@10V; Reverse Transfer Capacitance (Crss@Vds): 55pF@10V
U18 = GL823K-HCY04: 应用功能:-;接口协议:-;; Supplier Part: C284879; Manufacturer: GENESYS(创惟); Supplier Footprint: SSOP-16-150mil; JLCPCB Part Class: 扩展库; Datasheet: https://atta.szlcsc.com/upload/public/pdf/source/20190212/C284879_D3054E8AA735401C3047DCECFFFED6D3.pdf; Supplier: LCSC
D3 = 1N5819WS_C191023: 直流反向耐压(Vr):40V;平均整流电流(Io):1A;正向压降(Vf):600mV@1A;; LCSC Part Name: 40V 1A 600mV@1A; Supplier Part: C191023; Manufacturer: Hottech(合科泰); Supplier Footprint: SOD-323; JLCPCB Part Class: 基础库; Datasheet: https://atta.szlcsc.com/upload/public/pdf/source/20220428/3CB86FD8D28D653594B4E35F9D5AEFD9.pdf; Supplier: LCSC; Reverse Voltage (Vr): 40V; Average Rectified Current (Io): 1A; Forward Voltage (Vf@If): 600mV@1A
F1-F12 = FUSE0805: Operating Voltage (Max): 15V; Hold Current: 0.1A; Manufacturer Part: SMD0805-010C-15V; Manufacturer: BNstar(比诺星); Supplier: LCSC; Supplier Part: C22472472
R6-R8 R30-R33 = R0402: 电阻类型:厚膜电阻;阻值:10kΩ;精度:±1%;功率:100mW;温度系数:±100ppm/;最大工作电压:75V;工作温度范围:-55~+155;; Tolerance: ±1%; Power(Watts): 100mW; Overload Voltage (Max): 75V; Temperature Coefficient: ±100ppm/; Operating Temperature Range: -55~+155; LCSC Part Name: 10kΩ ±1% 100mW; Supplier Footprint: 0603; Datasheet: https://atta.szlcsc.com/upload/public/pdf/source/20200306/C422600_1E6D84923E4A46A82E41ADD87F860B5C.pdf; Type: 厚膜电阻
U5 = 74HC245KAJ: Supplier Part: C19192982; Manufacturer: FM(富满); Supplier Footprint: TSSOP-20; JLCPCB Part Class: 扩展库; Datasheet: https://atta.szlcsc.com/upload/public/pdf/source/20231116/FE00470B9356E6D4430EB785DA988E36.pdf; Supplier: LCSC
U6 = CH344Q: 应用功能:USB转UART;; Supplier Part: C2988084; Manufacturer: WCH(南京沁恒); Supplier Footprint: LQFP-48(7x7); JLCPCB Part Class: 扩展库; Datasheet: https://atta.szlcsc.com/upload/public/pdf/source/20220418/AB154A0A58B20703C58BC5378F7BDD74.pdf; Supplier: LCSC; Applications Function: USB转UART
U7 = CA-IS3762HB: LCSC Part Name: CA‐IS376x 高速六通道数字隔离器; Supplier Part: C19723482; Manufacturer: Chipanalog(川土微); Supplier Footprint: SSOP-16; JLCPCB Part Class: 扩展库; Datasheet: https://atta.szlcsc.com/upload/public/pdf/source/20231222/40CB9ED913182FAE3DD6992C77E8E643.pdf; Supplier: LCSC
U4 U8 = B0505S-1WR3_ST: 1W，定电压输入，非稳压单路输出，3000V隔离; Supplier Part: C131038; Manufacturer: MORNSUN(金升阳); Supplier Footprint: SIP,11.6x6mm; Datasheet: https://atta.szlcsc.com/upload/public/pdf/source/20171014/C133158_15079754745431038194.pdf; Supplier: LCSC; Number of channel: 1; Power: 1W; input voltage (Vdc): 4.5V~5.5V; Conversion Efficiency: 82%; Output Voltage: 5V; Output Current (Max): 200mA; Insulated Voltage: 3kV; Protective function: 短路保护
U9 = SP3232EEY-L/TR: 类型:收发器;驱动器/接收器:2/2;数据速率:235Kbps;; LCSC Part Name: +5V供电 多通道RS-232驱动器/接收器; Supplier Part: C13482; Manufacturer: MaxLinear(迈凌); Supplier Footprint: TSSOP-16; JLCPCB Part Class: 基础库; Datasheet: https://atta.szlcsc.com/upload/public/pdf/source/20191028/C442458_CF9E6BF1C13A99FECEB2D1BFD84B7081.pdf; Supplier: LCSC; Types: 收发器; Driver/receiver: 2/2; Data Rate: 235Kbps; Supply Voltage: 3V~5.5V; Operating Temperature: -40℃~+85℃
U10 U11 = 74LVC1T45DW-7: 电压(VCCA):1.65V~5.5V;电压(VCCB):1.65V~5.5V;电路数:1;每个电路通道数:1;; Supplier Part: C168855; Manufacturer: DIODES(美台); Supplier Footprint: SC-70-6(SOT-363); JLCPCB Part Class: 扩展库; Datasheet: https://atta.szlcsc.com/upload/public/pdf/source/20180109/C168856_15154706151821250215.pdf; Supplier: LCSC; Channel Type: 双向; Supply Voltage (VCCA): 1.65V~5.5V; Supply Voltage (VCCB): 1.65V~5.5V; Number of Circuits: 1; Channels per Circuit: 1; Output Type: 非反相；三态; Operating Temperature: -40℃~+125℃
U12 U13 = SIT3088ETK: DFN封装小外形，14Mbps高速，3.0V~5.5V供电，高静电半双工RS485/RS422芯片; LCSC Part Name: RS-485/RS-422芯片; Supplier Part: C601076; Manufacturer: SIT(芯力特); Supplier Footprint: DFN-8-EP(3x3); JLCPCB Part Class: 扩展库; Datasheet: https://atta.szlcsc.com/upload/public/pdf/source/20200610/C601074_2E843880C44A2DA1B7E0D38765D8E5FA.pdf; Supplier: LCSC
U14-U17 = TVS_SOT-23-3: polarity: 双向; Number of Lines: 双路; Type: ESD
U24 = LMV358AIDGKR: 放大器数:双路;增益带宽积(GBP):1MHz;输入偏置电流(Ib):10pA;压摆率(SR):1.7V/us;带宽(-3db):-;轨到轨:-;; Supplier Part: C408974; Manufacturer: TI(德州仪器); Supplier Footprint: VSSOP-8; Datasheet: https://www.ti.com/cn/lit/gpn/lmv358a; Supplier: LCSC; Number of Circuits: 双路; Gain Bandwidth Product(GBP): 1MHz; Current - Input Bias(Ib): 10pA; Slew Rate(SR): 1.7V/us; Output Current: 40mA; Operating Temperature: -40℃~+125℃
X1 X2 = XTAL3225
U19 = CH334R: Supplier Part: C4154405; Manufacturer: WCH(南京沁恒); Supplier Footprint: QSOP-16-150mil; JLCPCB Part Class: 扩展库; Datasheet: https://atta.szlcsc.com/upload/public/pdf/source/20240313/F70B229B132CE2CA6E618A7ACAF406E8.pdf; Supplier: LCSC
X3 = XTAL2520
D1 D2 = PESD1CAN: 极性:双向;反向截止电压(Vrwm):24V;最大钳位电压:50V;峰值脉冲电流(Ipp)@10/1000us:3A;峰值脉冲功率(Ppp)@10/1000us:200W;击穿电压:32V;; Supplier Part: C2977575; Manufacturer: KUU; Supplier Footprint: SOT-23; JLCPCB Part Class: Extended Part; Datasheet: https://atta.szlcsc.com/upload/public/pdf/source/20220223/AF3EADE717297C949E3FE397AF12ECBB.pdf; Supplier: LCSC; polarity: 双向; Reverse Stand-Off Voltage (Vrwm): 24V; Maximum Clamping Voltage: 50V; Peak Pulse Current (Ipp)@10/1000us: 3A; Peak Pulse Power Dissipation (Ppp)@10/1000us: 200W; Breakdown Voltage: 32V; Reverse Leakage Current (Ir): 1uA; Number of Lines: 双路; Operating Temperature: -55℃~+150℃@(Tj); Type: ESD
P1 = HDR1x5_1.27: 插针结构:1x5P;间距:1.27mm;行距:-;圆针/方针:方针;安装类型:直插;排数:单排;总PIN位数:5P;额定电流:1A;额定电压:250V;配合针长度:3.8mm;塑高:1mm;端接针长度:2.4mm;触头材质:黄铜;触头镀层:-;工作温度范围:-40℃~+105℃;焊接温度(最大值):260℃@10S;颜色:黑色;; LCSC Part Name: 1x5P 间距:1.27mm 方针 直插; Supplier Footprint: 插件,P=1.27mm; JLCPCB Part Class: 扩展库; Datasheet: https://atta.szlcsc.com/upload/public/pdf/source/20230316/674E7855FAF1BFD827413D68A2D1697C.pdf; Pin Structure: 1x5P; Pitch: 1.27mm; Circluar Pins/Square Pins: 方针; Mounting Type: 直插; Number of Rows: 单排; Number of Pins: 5P; Current Rating (Max): 1A; Voltage Rating (Max): 250V; Length of Mating Pin: 3.8mm; Insulation Height: 1mm; Length of End Connection Pin: 2.4mm; Contact Material: 黄铜; Operating Temperature Range: -40℃~+105℃; Soldering Temperature(Max): 260℃@10S; Color: 黑色
U1 U2 = SIT1057TK/3: Supplier Part: C5382538; Manufacturer: SIT(芯力特); Supplier Footprint: DFN-8(3x3); JLCPCB Part Class: 扩展库; Datasheet: https://atta.szlcsc.com/upload/public/pdf/source/20230320/4014639E077B9DB6E4A0EA2BBF085938.pdf; Supplier: LCSC
U3 = CA-IS3742HB: 4通道数字隔离器,电容隔离; LCSC Part Name: CA-IS374x 高速四通道数字隔离器; Supplier Part: C7370896; Manufacturer: Chipanalog(川土微); Supplier Footprint: SSOP16-NB(B); JLCPCB Part Class: 扩展库; Datasheet: https://atta.szlcsc.com/upload/public/pdf/source/20240402/A6B3DE0FE33F5A1BA9DC823DA65C6095.pdf; Supplier: LCSC; Number of Forward Channels: 2; Number of Reverse Channels: 2; Data Rate(Max): 150Mbps; Isolation Voltage(Vrms): 3750; CMTI(kV/us): 150kV/us; Integrated Power Supply: 否; Operating Temperature: -40℃~125℃; Rating: 工业级
U23 = STM32F405RGT6: CPU内核:CM4;程序存储容量:1MB;RAM总容量:192KB;GPIO端口数量:51;工作电压范围:1.8V~3.6V;CPU最大主频:168MHz;程序存储器类型:FLASH;; Supplier Part: C15742; Manufacturer: ST(意法半导体); Supplier Footprint: LQFP-64(10x10); JLCPCB Part Class: 扩展库; Datasheet: https://atta.szlcsc.com/upload/public/pdf/source/20140801/1457707197138.pdf; Supplier: LCSC; CPU Core: CM4; Program Storage Size: 1MB; RAM Size: 192KB; GPIO Ports Number: 51; Operating Voltage Range: 1.8V~3.6V; CPU Maximum Speed: 168MHz; Program Memory Type: FLASH; Operating Temperature Range: -40℃~+85℃; ADC (Bit): 12bit; DAC (Bit): 12bit; Universal Serial Bus: 有; Peripheral/Function: DMA；LCD/LED驱动；PWM; Watchdog: 有; Infrared Data Association: 有; Low-Voltage Detect: 有; LCD Module: 有; Direct Memory Access: 有; Internal Oscillator: 有

## Nets
3.3V: C48.2 C49.2 C53.2 C55.2 L1.2 P3.5 P3.6 R37.2 R46.2 R48.2 R50.2 R52.2 R53.2 U19.12(V5) U19.13(VDD33)
5V: B1.1 C50.2 C51.2 P3.3 P3.4 Q1.2(S) R34.2 R43.2 R45.2 R47.2 R49.2 R51.2 U20.1(EN) U20.4(VIN) U22.5(IN)
GND: C1.1 C2.2 C3.1 C4.1 C5.1 C6.1 C7.2 C8.1 C9.1 C10.2 C11.1 C15.1 C17.1 C18.2 C19.1 C20.1 C21.1 C22.1 C23.1 C24.1 C25.1 C26.1 C28.2 C30.2 C32.1 C34.1 C35.1 C36.2 C37.1 C38.1 C39.1 C42.2 C43.1 C44.2 C45.1 C46.2 C47.1 C48.1 C49.1 C50.1 C51.1 C52.1 C55.1 C56.1 CARD1.6(VSS) CARD1.10 CARD1.13 D4.2(GND) P3.1 P3.2 P3.31 P3.32 P4.1 P4.3 P4.5 P4.7 P4.9 P4.11 P4.13 P4.15 P4.17 P4.19 P4.20 P4.31 P4.32 R17.1 R18.1 R19.2 R21.2 R25.2 R35.2 R38.1 R40.1 R44.1 U3.2(GNDA) U3.8(GNDA) U4.1(GND) U5.10(GND) U5.19(OE#) U6.8(GND) U6.20(GND) U6.23(GND) U6.35(GND) U6.44(TEST) U6.47(GND) U7.8(GNDA) U8.1(GND) U9.15(GND) U10.2(GND) U11.2(GND) U11.5(DIR) U14.3 U15.3 U18.1(VSS) U18.14(VSS) U19.14(GND) U20.2(GND) U21.2(GND) U22.2(GND) U23.12(VSSA) U23.18(VSS) U23.60(BOOT0) U23.63(VSS) U24.3(+INA) U24.4(V-) USB1.1(GND) USB1.12(GND) X1.2(GND) X1.4(GND) X2.2(GND) X2.4(GND) X3.2(GND) X3.4(GND)
CAN1_H: F1.2
CAN1_L: F2.2
CAN2_H: F3.2
CAN2_L: F4.2
CAN_5V: C12.1 C13.1 C14.1 C16.2 U1.3(VCC) U1.5(VIO) U2.3(VCC) U2.5(VIO) U3.10(ENB) U3.16(VDDB) U4.4(+VO)
CAN_G: C12.2 C13.2 C14.2 C16.1 D1.3 D2.3 U1.2(GND) U1.8(S) U1.9(EP) U2.2(GND) U2.8(S) U2.9(EP) U3.9(GNDB) U3.15(GNDB) U4.3(0V)
D_1.8V: C54.2 C56.2 L2.2 P3.9 P3.10 R39.2
D_3.3V: P3.7 P3.8 R53.1
D_5V: B1.2 C52.2 U21.1(EN) U21.4(VIN)
HOST_USB_DM: D4.1(I/O1) D4.6(I/O1) U19.5(DM2) USB1.5(DN2) USB1.7(DN1)
HOST_USB_DP: D4.3(I/O2) D4.4(I/O2) U19.6(DP2) USB1.6(DP1) USB1.8(DP2)
HUB1_USB_DM: P4.12 U19.10(DMU)
HUB1_USB_DP: P4.14 U19.11(DPU)
J_3.3V: D6.3(A) D6.4(A) P3.13 P3.14 R52.1
J_5V: P3.11 P3.12 R51.1
J_CAN1_H: P2.1
J_CAN1_L: P2.3
J_CAN2_H: P2.2
J_CAN2_L: P2.4
J_LED_GREEN: P3.29 P3.30 R56.2
J_LED_RED: P3.27 P3.28 R57.2
J_RS485_A1: P2.7
J_RS485_A2: P2.8
J_RS485_B1: P2.9
J_RS485_B2: P2.10
LED_CAN1_RX: R2.1 U23.17(PA3)
LED_CAN1_TX: R1.1 U23.16(PA2)
LED_CAN2_RX: R4.1 U23.38(PC7)
LED_CAN2_TX: R3.1 U23.37(PC6)
LED_STATUS: R5.1 U23.51(PC10)
O_3.3V: D5.3(A) D5.4(A) P4.25 P4.26 R50.1 SW1.3 SW1.6
O_5V: P4.27 P4.28 R49.1 SW1.4 SW1.5
O_LED_GREEN: P3.25 P3.26 R54.2
O_LED_RED: P3.23 P3.24 R55.2
O_VOUT: P4.29 P4.30 SW1.2 SW1.7
R_3.3V: C45.2 C46.1 LED14.2(+) U18.9(VDD) U18.13(VDDA)
R_CD: CARD1.CD Q1.1(G) R34.1
R_USB_DM: P4.8 U18.16(DM)
R_USB_DP: P4.10 U18.15(DP)
RS232_RXD: F5.2
RS232_TXD: F6.2
RS485_5V: C31.2 C33.1 C40.1 C41.1 R30.2 R32.2 U7.16(VDDB) U8.4(+VO) U12.8(VCC) U13.8(VCC)
RS485_A1: F10.2
RS485_A2: F12.2
RS485_B1: F9.2
RS485_B2: F11.2
RS485_G: C31.1 C33.2 C40.2 C41.2 R31.1 R33.1 U7.9(GNDB) U8.3(0V) U12.5(GND) U12.9(EP) U13.5(GND) U13.9(EP) U16.3 U17.3
SOC_USB_DM: P4.4
SOC_USB_DP: P4.2
U_3.3V: C19.2 C20.2 C21.2 C23.2 C24.2 C25.2 C34.2 C35.2 C36.1 LED6.2(+) LED7.2(+) LED8.2(+) LED9.2(+) LED10.2(+) LED11.2(+) LED12.2(+) LED13.2(+) R8.2 R48.1 U5.1(DIR) U5.20(VCC) U6.9(VCC) U6.24(VCC) U6.36(VCC) U6.48(VCC) U7.1(VDDA) U9.16(VCC) U10.1(VCCA) U10.5(DIR) U11.1(VCCA)
U_5V: C26.2 C42.1 R47.1 U8.2(VIN) U24.8(V+)
U_RST: C22.2 R8.1 U6.7(RESET)
U_USB_DM: U6.42(UD-) U19.7(DM1)
U_USB_DP: U6.43(UD+) U19.8(DP1)
U_VBUS: D4.5(VBUS) R41.1 R42.1 U22.1(OUT) USB1.2(VBUS) USB1.11(VBUS)
U_VIO: C37.2 C38.2 C39.2 R24.1 R28.1 R29.1 U10.6(VCCB) U11.6(VCCB)
U_VREF_PWM: P3.21 P3.22 R19.1 R20.1
U_XI: C18.1 U6.5(XI) X2.1
U_XO: C17.2 U6.6(XO) X2.3
UART0_RTC: R17.2 U6.39(TNOW0/GPIO8) U7.2(VI1)
UART0_RTC1: U7.15(VO1) U12.2(RE#) U12.3(DE)
UART0_RXD: U5.3(A2) U6.31(RXD0) U7.6(VO5)
UART0_RXD1: U7.11(VI5) U12.1(RO)
UART0_TXD: U5.2(A1) U6.30(TXD0) U7.3(VI2)
UART0_TXD1: U7.14(VO2) U12.4(DI)
UART1_RTC: R18.2 U6.18(TNOW1/GPIO9) U7.4(VI3)
UART1_RTC1: U7.13(VO3) U13.2(RE#) U13.3(DE)
UART1_RXD: U5.5(A4) U6.13(RXD1) U7.7(VO6)
UART1_RXD1: U7.10(VI6) U13.1(RO)
UART1_TXD: U5.4(A3) U6.12(TXD1) U7.5(VI4)
UART1_TXD1: U7.12(VO4) U13.4(DI)
UART2_RXD: U5.7(A6) U6.22(RXD2) U9.9(R2OUT)
UART2_TXD: U5.6(A5) U6.21(TXD2) U9.10(T2IN)
UART3_RXD: R23.1 U5.9(A8) U6.38(RXD3)
UART3_TXD: R22.1 U5.8(A7) U6.37(TXD3)
UART_RXD: F8.2
UART_TXD: F7.2
USB_SWITCH: P4.6
V_3.3V: C1.2 C2.1 C3.2 C4.2 C5.2 C11.2 LED1.2(+) LED2.2(+) LED3.2(+) LED4.2(+) LED5.2(+) R6.2 R7.2 R46.1 U3.1(VDDA) U3.7(ENA) U23.1(VBAT) U23.13(VDDA) U23.19(VDD) U23.32(VDD) U23.48(VDD) U23.64(VDD)
V_5V: C15.2 R45.1 U4.2(VIN)
V_CAN1_RX: U3.5(VO3) U23.61(PB8)
V_CAN1_RX1: U1.4(RXD) U3.12(VI3)
V_CAN1_TX: R6.1 U3.3(VI1) U23.62(PB9)
V_CAN1_TX1: U1.1(TXD) U3.14(VO1)
V_CAN2_RX: U3.6(VO4) U23.57(PB5)
V_CAN2_RX1: U2.4(RXD) U3.11(VI4)
V_CAN2_TX: R7.1 U3.4(VI2) U23.58(PB6)
V_CAN2_TX1: U2.1(TXD) U3.13(VO2)
V_RST: C10.1 U23.7(NRST)
V_SWC: U23.49(PA14(JTCK-SWCLK))
V_SWD: U23.46(PA13(JTMS-SWDIO))
V_USB_DM: U19.3(DM3) U23.35(PB14)
V_USB_DP: U19.4(DP3) U23.36(PB15)
$1N3069: R41.2 USB1.10(CC2)
$1N3071: R42.2 USB1.4(CC1)
$1N5971: D5.2(K) R54.1
$1N5973: D5.1(K) R55.1
$1N6094: D6.1(K) R57.1
$1N6096: D6.2(K) R56.1
$1N11840: L2.1 U21.3(SW)
$1N11841: C54.1 R39.1 R40.2 U21.5(FB)
$1N12309: L1.1 U20.3(SW)
$1N12310: C53.1 R37.1 R38.2 U20.5(FB)
$1N17961: R44.2 U22.3(ISET)
$1N17962: R43.1 U22.4(EN)
$3N2411: F10.1 R30.1 U12.6(A) U16.1
$3N2413: F9.1 R31.2 U12.7(B) U16.2
$3N2949: F12.1 R32.1 U13.6(A) U17.1
$3N2961: F11.1 R33.2 U13.7(B) U17.2
$3N6150: C27.1 U9.1(C1+)
$3N6154: C27.2 U9.3(C1-)
$3N6187: C29.1 U9.4(C2+)
$3N6191: C29.2 U9.5(C2-)
$3N6279: C28.1 U9.2(V+)
$3N6283: C30.1 U9.6(V-)
$3N18347: F6.1 U9.7(T2OUT) U14.1
$3N18365: F5.1 U9.8(R2IN) U14.2
$3N18967: LED6.1(-) R9.1
$3N18969: LED7.1(-) R10.1
$3N18971: LED8.1(-) R11.1
$3N18973: LED9.1(-) R12.1
$3N18975: LED10.1(-) R13.1
$3N18977: LED11.1(-) R14.1
$3N18979: LED12.1(-) R15.1
$3N18981: LED13.1(-) R16.1
$3N18985: R16.2 U5.11(B8)
$3N18990: R15.2 U5.12(B7)
$3N19003: R12.2 U5.15(B4)
$3N19013: R11.2 U5.16(B3)
$3N19019: R10.2 U5.17(B2)
$3N19030: R9.2 U5.18(B1)
$3N19079: R13.2 U5.14(B5)
$3N19084: R14.2 U5.13(B6)
$3N20830: R26.1 U10.4(B)
$3N20831: F7.1 R26.2 U15.1
$3N20841: R22.2 U10.3(A)
$3N21122: F8.1 R27.2 R29.2 U15.2
$3N21125: R27.1 U11.4(B)
$3N21131: R23.2 U11.3(A)
$3N21778: C32.2 R20.2 R21.1 U24.5(+INB)
$3N21779: R24.2 R25.1 U24.6(-INB)
$3N21827: U24.1(OUTA) U24.2(-INA)
$3N21886: D3.1(K) R28.2
$3N21889: D3.2(A) U24.7(OUTB)
$4N2853: C7.1 U23.5(PH0-OSC_IN(PH0)) X1.1
$4N2854: C8.2 U23.6(PH1-OSC_OUT(PH1)) X1.3
$4N5225: C6.2 U23.47(VCAP_2)
$4N5229: C9.2 U23.31(VCAP_1)
$4N5818: LED1.1(-) R1.2
$4N5859: LED2.1(-) R2.2
$4N5901: LED3.1(-) R3.2
$4N5943: LED4.1(-) R4.2
$4N5985: LED5.1(-) R5.2
$4N17195: D1.1 F1.1 U1.7(CANH)
$4N17198: D1.2 F2.1 U1.6(CANL)
$4N17651: D2.1 F3.1 U2.7(CANH)
$4N17653: D2.2 F4.1 U2.6(CANL)
$7N186: CARD1.1(DAT2) U18.7(D2)
$7N188: CARD1.2(CD/DAT3) U18.6(D3)
$7N190: CARD1.3(CMD) U18.5(CMD)
$7N202: CARD1.8(DAT1) U18.2(D1)
$7N208: CARD1.7(DAT0) U18.3(D0)
$7N215: CARD1.5(CLX) U18.4(CLK)
$7N227: C47.2 CARD1.4(VDD) U18.8(PMOS)
$7N402: C43.2 C44.1 Q1.3(D) U18.10(5V)
$7N589: LED14.1(-) R36.2
$7N594: R36.1 U18.12(LED)
$7N898: R35.1 U18.11(GPIO)
$8N259: U19.15(XO) X3.3
$8N263: U19.16(XI) X3.1

Not connected (* = marked no-connect by the designer): CARD1 11* 12*; CN1 1 2 3 4 5 6 7 8 9 10 11 12 13 14 15 16 17* 18* 19* 20*; P1 1 2 3 4 5; P3 15* 16* 17* 18* 19* 20*; P4 16* 18* 21* 22* 23* 24*; SW1 1 8 9* 10* 11* 12*; U6 1(NC)* 2(DSR2)* 3(RI2)* 4(DCD2)* 10(CTS1/GPIO2)* 11(RTS1/GPIO3)* 14(ACT)* 15(TX_S)* 16(RX_S)* 17(DSR1) 19(TNOW2/GPIO10)* 25(RI1)* 26(CTS2/GPIO4)* 27(RTS2/GPIO5)* 28(DCD1/ GPIO15)* 29(DSR0/ GPIO14)* 32(RI0/ GPIO13)* 33(DCD0/ GPIO12)* 34(TNOW3/ DTR3/ GPIO11)* 40(RTS0/GPIO1)* 41(CTS0/GPIO0)* 45(RTS3/GPIO7)* 46(CTS3/GPIO6)*; U9 11(T1IN)* 12(R1OUT)* 13(R1IN)* 14(T1OUT)*; U19 1(DM4)* 2(DP4)* 9(RESET#/CDP)*; U23 2(PC13)* 3(PC14-OSC32_IN(PC14))* 4(PC15-OSC32_OUT(PC15))* 8(PC0)* 9(PC1)* 10(PC2)* 11(PC3)* 14(PA0-WKUP(PA0))* 15(PA1)* 20(PA4)* 21(PA5)* 22(PA6)* 23(PA7)* 24(PC4)* 25(PC5)* 26(PB0)* 27(PB1)* 28(PB2-BOOT1(PB2))* 29(PB10)* 30(PB11)* 33(PB12)* 34(PB13)* 39(PC8)* 40(PC9)* 41(PA8)* 42(PA9)* 43(PA10)* 44(PA11)* 45(PA12)* 50(PA15(JTDI))* 52(PC11)* 53(PC12)* 54(PD2)* 55(PB3(JTDOTRACESWO))* 56(PB4(NJTRST))* 59(PB7)*; USB1 3(SBU2)* 9(SBU1)* 13(SHELL)* 16(SHELL)*

## Notes on the sheets
sheet 1
- 3.3V电源
- 板间连接排母
- 1.8V电源
- OSBDM电源开关
- 电源跳线
- 端子
- 6.8/12K=567mA
- USB主机过流保护
- OSBDM&X-Link指示灯
- Type-C接口
- USB TVS
sheet 2
- 信号隔离
- RS485_1
- 收发指示灯
- 隔离电源
- RS485_2
- 晶体
- 复位
- RTC配置
- RS232
- UART
- UART电压缓冲
- USB转4路UART
sheet 3
- CAN1
- CAN2
- 单片机
- 信号隔离
- 隔离电源
- SWD接口
